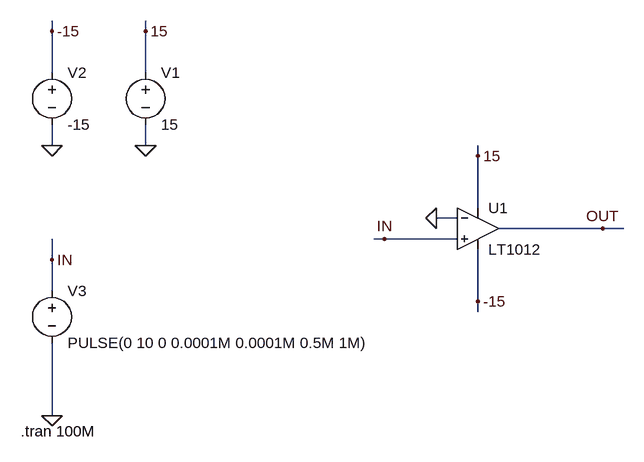
[diagram p0: schematic SimpleComparator.asc]
SimpleComparator.asc, the LTspice schematic file:
Version 4
SHEET 1 880 680
WIRE -272 -304 -272 -320
WIRE -128 -304 -128 -320
WIRE -272 -240 -272 -304
WIRE -128 -240 -128 -304
WIRE -272 -128 -272 -160
WIRE -128 -128 -128 -160
WIRE 384 -112 384 -128
WIRE 384 -32 384 -112
WIRE 352 -16 320 -16
WIRE 576 0 416 0
WIRE 608 0 576 0
WIRE 240 16 224 16
WIRE 352 16 240 16
WIRE -272 48 -272 16
WIRE -272 96 -272 48
WIRE 384 112 384 32
WIRE 384 128 384 112
WIRE -272 288 -272 176
FLAG 320 -16 0
FLAG 576 0 OUT
FLAG 240 16 IN
FLAG 384 -112 15
FLAG 384 112 -15
FLAG -128 -128 0
FLAG -272 -128 0
FLAG -128 -304 15
FLAG -272 -304 -15
FLAG -272 288 0
FLAG -272 48 IN
SYMBOL Opamps\\LT1012 384 -64 R0
SYMATTR InstName U1
SYMBOL voltage -128 -256 R0
WINDOW 123 0 0 Left 2
WINDOW 39 0 0 Left 2
SYMATTR InstName V1
SYMATTR Value 15
SYMBOL voltage -272 -256 R0
WINDOW 123 0 0 Left 2
WINDOW 39 0 0 Left 2
SYMATTR InstName V2
SYMATTR Value -15
SYMBOL voltage -272 80 R0
WINDOW 123 0 0 Left 2
WINDOW 39 0 0 Left 2
SYMATTR InstName V3
SYMATTR Value PULSE(0 10 0 0.0001M 0.0001M 0.5M 1M)
TEXT -320 312 Left 2 !.tran 100M

The netlist it stands for:
* SimpleComparator.asc
XU1 IN 0 15 -15 OUT LT1012  ; pins In+ In- V+ V- OUT
V1 15 0 15
V2 -15 0 -15
V3 IN 0 PULSE(0 10 0 0.0001M 0.0001M 0.5M 1M)
.tran 100M
.backanno
.end